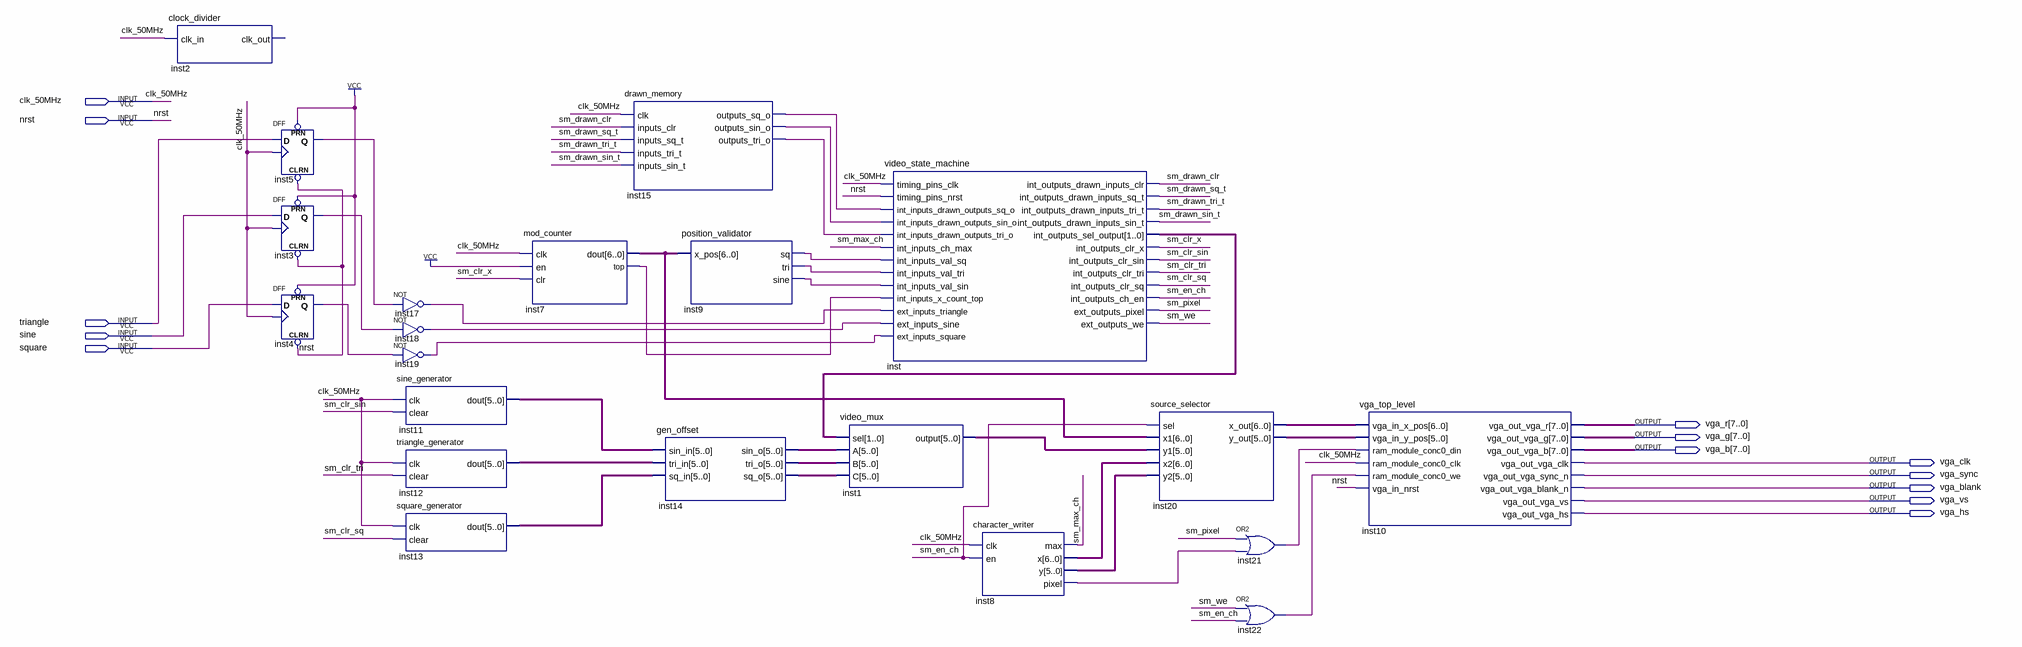
[diagram p0: schematic sheet]
// Quartus schematic top_level.bdf as structural Verilog: 21 symbols, 13 pins
module top_level (
  input  clk_50MHz,
  input  nrst,
  input  triangle,
  input  sine,
  input  square,
  output [7:0] vga_r,
  output [7:0] vga_g,
  output [7:0] vga_b,
  output vga_clk,
  output vga_sync,
  output vga_blank,
  output vga_vs,
  output vga_hs
);

  wire inst3_q, inst4_q, inst5_q, inst7_top, inst8_pixel, inst9_sine, inst9_sq, inst9_tri,
       inst15_outputs_sin_o, inst15_outputs_sq_o, inst15_outputs_tri_o, inst17_out, inst18_out, inst19_out,
       inst21_out, inst22_out, sm_clr_sin, sm_clr_sq, sm_clr_tri, sm_clr_x, sm_drawn_clr, sm_drawn_sin_t,
       sm_drawn_sq_t, sm_drawn_tri_t, sm_en_ch, sm_max_ch, sm_pixel, sm_we;
  wire [1:0] inst_int_outputs_sel_output;
  wire [5:0] inst1_output, inst8_y, inst11_dout, inst12_dout, inst13_dout, inst14_sin_o, inst14_sq_o,
       inst14_tri_o, inst20_y_out;
  wire [6:0] inst7_dout, inst8_x, inst20_x_out;

  clock_divider inst2 (.clk_in(clk_50MHz));  // open: clk_out
  DFF inst5 (.CLRN(nrst), .CLK(clk_50MHz), .D(triangle), .PRN(1'b1), .Q(inst5_q));
  DFF inst3 (.CLRN(nrst), .CLK(clk_50MHz), .D(sine), .PRN(1'b1), .Q(inst3_q));
  DFF inst4 (.CLRN(nrst), .CLK(clk_50MHz), .D(square), .PRN(1'b1), .Q(inst4_q));
  not inst17 (inst17_out, inst5_q);
  not inst18 (inst18_out, inst3_q);
  not inst19 (inst19_out, inst4_q);
  sine_generator inst11 (.clk(clk_50MHz), .clear(sm_clr_sin), .dout(inst11_dout));
  triangle_generator inst12 (.clk(clk_50MHz), .clear(sm_clr_tri), .dout(inst12_dout));
  square_generator inst13 (.clk(clk_50MHz), .clear(sm_clr_sq), .dout(inst13_dout));
  mod_counter inst7 (.clk(clk_50MHz), .en(1'b1), .clr(sm_clr_x), .dout(inst7_dout), .top(inst7_top));
  drawn_memory inst15 (
    .clk(clk_50MHz), .inputs_clr(sm_drawn_clr), .inputs_sq_t(sm_drawn_sq_t), .inputs_tri_t(sm_drawn_tri_t),
    .inputs_sin_t(sm_drawn_sin_t), .outputs_sq_o(inst15_outputs_sq_o), .outputs_sin_o(inst15_outputs_sin_o),
    .outputs_tri_o(inst15_outputs_tri_o));
  position_validator inst9 (.x_pos(inst7_dout), .sq(inst9_sq), .sine(inst9_sine), .\tri (inst9_tri));
  gen_offset inst14 (
    .sin_in(inst11_dout), .tri_in(inst12_dout), .sq_in(inst13_dout), .sin_o(inst14_sin_o),
    .tri_o(inst14_tri_o), .sq_o(inst14_sq_o));
  video_mux inst1 (
    .sel(inst_int_outputs_sel_output), .A(inst14_sin_o), .B(inst14_tri_o), .C(inst14_sq_o),
    .\output (inst1_output));
  video_state_machine inst (
    .timing_pins_clk(clk_50MHz), .timing_pins_nrst(nrst),
    .int_inputs_drawn_outputs_sq_o(inst15_outputs_sq_o),
    .int_inputs_drawn_outputs_sin_o(inst15_outputs_sin_o),
    .int_inputs_drawn_outputs_tri_o(inst15_outputs_tri_o), .int_inputs_ch_max(sm_max_ch),
    .int_inputs_val_sq(inst9_sq), .int_inputs_val_tri(inst9_tri), .int_inputs_val_sin(inst9_sine),
    .int_inputs_x_count_top(inst7_top), .ext_inputs_triangle(inst17_out), .ext_inputs_sine(inst18_out),
    .ext_inputs_square(inst19_out), .int_outputs_drawn_inputs_clr(sm_drawn_clr),
    .int_outputs_drawn_inputs_sq_t(sm_drawn_sq_t), .int_outputs_drawn_inputs_tri_t(sm_drawn_tri_t),
    .int_outputs_drawn_inputs_sin_t(sm_drawn_sin_t), .int_outputs_sel_output(inst_int_outputs_sel_output),
    .int_outputs_clr_x(sm_clr_x), .int_outputs_clr_sin(sm_clr_sin), .int_outputs_clr_tri(sm_clr_tri),
    .int_outputs_clr_sq(sm_clr_sq), .int_outputs_ch_en(sm_en_ch), .ext_outputs_pixel(sm_pixel),
    .ext_outputs_we(sm_we));
  character_writer inst8 (
    .clk(clk_50MHz), .en(sm_en_ch), .max(sm_max_ch), .x(inst8_x), .y(inst8_y), .pixel(inst8_pixel));
  source_selector inst20 (
    .sel(sm_en_ch), .x1(inst7_dout), .y1(inst1_output), .x2(inst8_x), .y2(inst8_y), .x_out(inst20_x_out),
    .y_out(inst20_y_out));
  or inst21 (inst21_out, sm_pixel, inst8_pixel);
  or inst22 (inst22_out, sm_we, sm_en_ch);
  vga_top_level inst10 (
    .vga_in_x_pos(inst20_x_out), .vga_in_y_pos(inst20_y_out), .ram_module_conc0_din(inst21_out),
    .ram_module_conc0_clk(clk_50MHz), .ram_module_conc0_we(inst22_out), .vga_in_nrst(nrst),
    .vga_out_vga_r(vga_r), .vga_out_vga_g(vga_g), .vga_out_vga_b(vga_b), .vga_out_vga_clk(vga_clk),
    .vga_out_vga_sync_n(vga_sync), .vga_out_vga_blank_n(vga_blank), .vga_out_vga_vs(vga_vs),
    .vga_out_vga_hs(vga_hs));
endmodule
